# Altium schematic sheet MCU_oscilliation.SchDoc
size A4
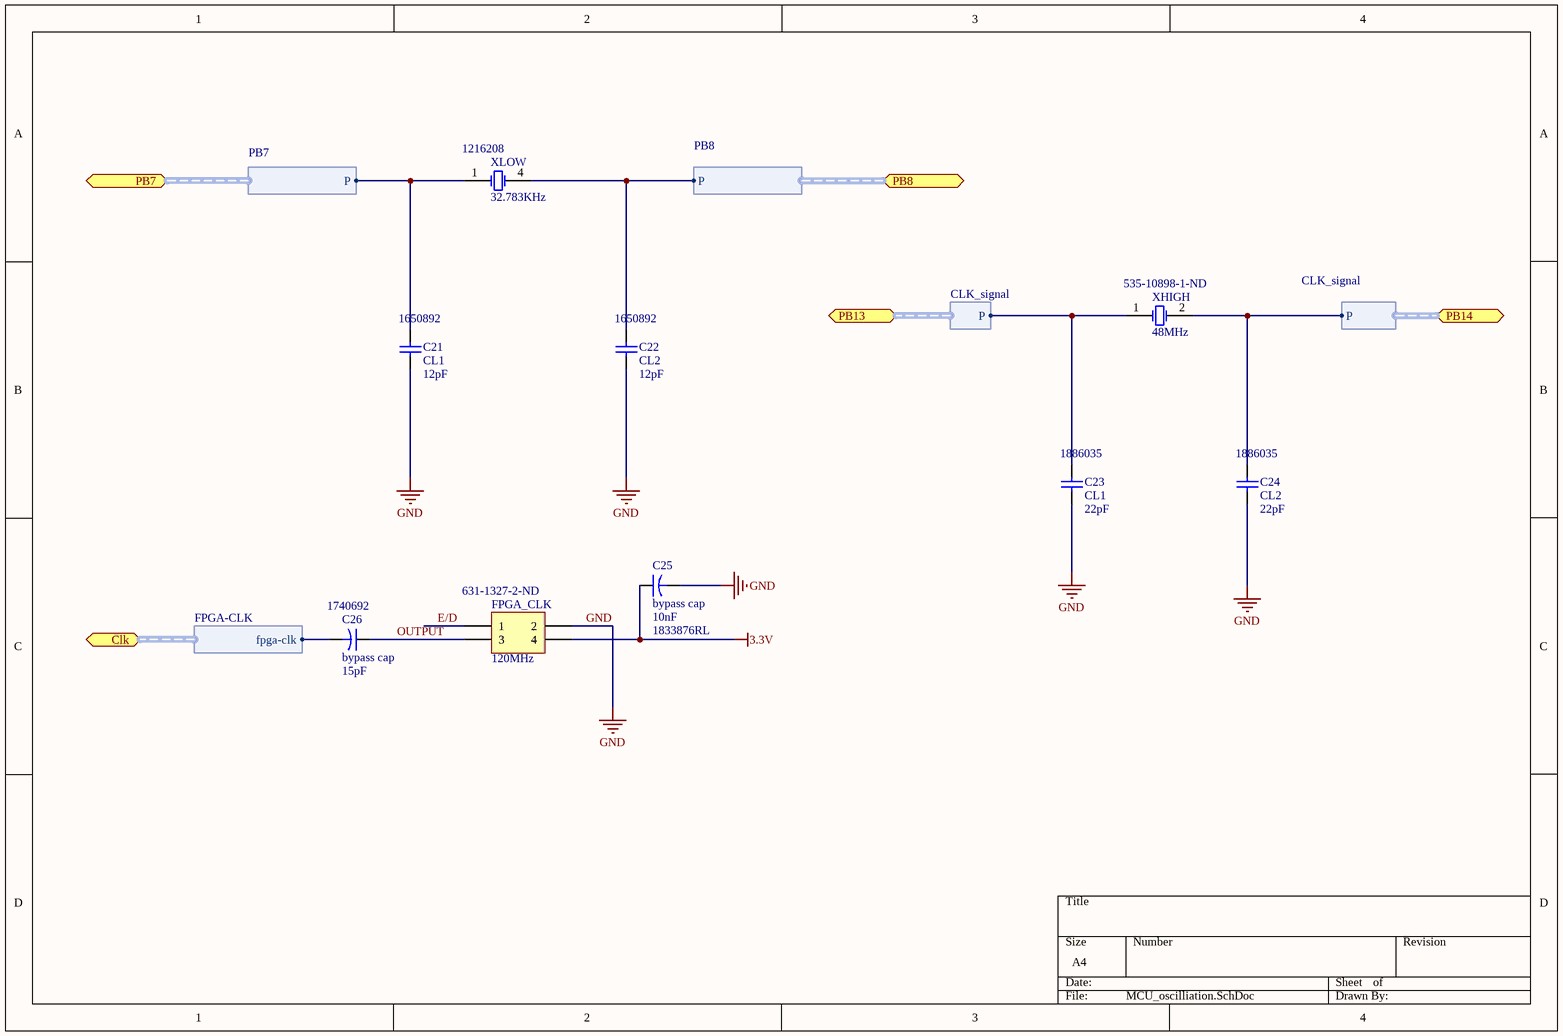
[diagram p0: MCU_oscilliation.SchDoc]

## Parts
C21  CL1  value 12pF  Supplier Part Number 1: 1650892  [C1206]
C22  CL2  value 12pF  Supplier Part Number 1: 1650892  [C1206]
C23  CL1  value 22pF  Supplier Part Number 1: 1886035  [C1206]
C24  CL2  value 22pF  Supplier Part Number 1: 1886035  [C1206]
C25  bypass cap  value 10nF  Supplier Part Number 1: 1833876RL  [C1206]
C26  bypass cap  value 15pF  Supplier Part Number 1: 1740692  [C1206]
FPGA_CLK  120MHz  Supplier Part Number 1: 631-1327-2-ND  [OSCI-4FPGA]
XHIGH  48MHz  Supplier Part Number 1: 535-10898-1-ND  [XTAL-85]
XLOW  32.783KHz  Supplier Part Number 1: 1216208  [MC-306]

## Ports
Clk (harness FPGA-CLK), PB7 (harness PB7), PB8 (harness PB8), PB13 (harness CLK_signal), PB14 (harness CLK_signal)

## Harnesses
PB7: P
PB8: P
CLK_signal: P
FPGA-CLK: fpga-clk

## Nets
3.3V: C25.1 FPGA_CLK.4
GND: C21.1 C22.1 C23.1 C24.1 C25.2 FPGA_CLK.2
E/D: FPGA_CLK.1
OUTPUT: C26.1 FPGA_CLK.3
NetC21_2: C21.2 XLOW.1(OSC1) ; port PB7.P
NetC22_2: C22.2 XLOW.4(OSC2) ; port PB8.P
NetC23_2: C23.2 XHIGH.1(OSC1) ; port PB13.P
NetC24_2: C24.2 XHIGH.2(OSC2) ; port PB14.P
NetC26_2: C26.2 ; port Clk.fpga-clk

## Library data of the parts
C21 C22 = Cap Semi: Capacitor (Semiconductor SIM Model); Manufacturer: KEMET; Manufacturer Part Number: C1206C120J5GACTU; Product Range: KEMET - C Series; Capacitance: 12; Capacitance Tolerance: ± 5%; Dielectric Characteristic: C0G / NP0; Voltage Rating: 50; Ceramic Capacitor Case: 1206 [3216 Metric]; SVHC: No SVHC (16-Dec-2013); Capacitor Terminals: SMD; Temperature Coefficient: 0ppm/°C ± 30; Published: 8-Jun-2000; LatestRevisionDate: 29-May-2009; LatestRevisionNote: IPC-7351 Footprint Added.; PackageReference: C1206; Publisher: Altium Limited; PackageDescription: Chip Capacitor; Supplier 1: Farnell; RoHS: YES; Stock 1: 13114; Pricing 1: 1=1.12, 25=0.95, 50=0.52, 100=0.34, 500=0.29 (EUR); Operating Temperature Min: -55; Operating Temperature Max: 125; Packaging: Cut Tape; MSL: MSL 1 - Unlimited; Capacitance Tolerance ±: ± 5%; Capacitor Case Style: 1206 [3216 Metric]; Operating Temperature Range: -55°C to +125; ComponentLink1URL: http://www.farnell.com/datasheets/1732697.pdf; ComponentLink1Description: http://www.farnell.com/datasheets/1732697.pdf
C23 C24 = Cap Semi: Capacitor (Semiconductor SIM Model); Manufacturer: JOHANSON DIELECTRICS; Manufacturer Part Number: 102R18N220JV4E; Published: 8-Jun-2000; LatestRevisionDate: 29-May-2009; LatestRevisionNote: IPC-7351 Footprint Added.; PackageReference: C1206; Publisher: Altium Limited; PackageDescription: Chip Capacitor; Supplier 1: Farnell; RoHS: YES; Stock 1: 3550; Pricing 1: 50=1.3, 250=0.859, 500=0.626, 1000=0.509, 3000=0.478 (EUR); ComponentLink1URL: http://www.johansondielectrics.com/product-catalog.html; ComponentLink1Description: http://www.johansondielectrics.com/product-catalog.html; ComponentLink2URL: http://www.johansondielectrics.com/images/stories/catalog/JDI_Full-Catalog_2012-01.pdf; ComponentLink2Description: http://www.johansondielectrics.com/images/stories/catalog/JDI_Full-Catalog_2012-01.pdf
C25 C26 = Cap2: Capacitor; Manufacturer: AVX; Manufacturer Part Number: 06031C103JAT2A; Capacitance: 0.01; Capacitance Tolerance: ± 5%; Dielectric Characteristic: X7; Voltage Rating: 100; Ceramic Capacitor Case: 0603 ^1608 Metric]; Published: 23-Sep-2002; PackageReference: CAPR5-4X5; Publisher: Altium Limited; PackageDescription: Capacitor; 2 Leads; RoHS: YES; Product Range: -; Packaging: Cut Tape; ComponentLink1URL: http://www.farnell.com/datasheets/84526.pdf; ComponentLink1Description: http://www.farnell.com/datasheets/84526.pdf; Supplier 1: Farnell
FPGA_CLK = Header 2X2: Header, 2-Pin, Dual row; Manufacturer: Fox Electronics; Manufacturer Part Number: FXO-HC736R-120; Function: Tri-State (Output Enable); Output: HCMOS; Voltage - Supply: 3.3V; Frequency Stability: ±25ppm; Current - Supply (Max): 47mA; LatestRevisionDate: 17-Jul-2002; LatestRevisionNote: Re-released for DXP Platform.; Publisher: Altium Limited; Supplier 1: Digi-Key; RoHS: RoHS Compliant; Category: Crystals and Oscillators; Stock 1: 200; Pricing 1: 1000=1.42097, 3000=1.32297, 5000=1.27398, 10000=1.22498 (EUR); Packaging: Tape & Reel (TR); Type: XO (Standard); Frequency: 120MHz; Operating Temperature: -40°C ~ 85°C; Ratings: -; Mounting Type: Surface Mount; Size / Dimension: 0.295" L x 0.205" W (7.50mm x 5.20mm); Height: 0.055" (1.40mm); Package / Case: 4-SMD, No Lead (DFN, LCC); Current - Supply (Disable) (Max): -; ComponentLink1URL: http://www.foxonline.com/pdfs/FXO_HC73.pdf; ComponentLink1Description: http://www.foxonline.com/pdfs/FXO_HC73.pdf
XHIGH = XTAL: Crystal Oscillator; Manufacturer: Abracon Corporation; Manufacturer Part Number: ABM2-48.000MHZ-D4YF-T; Frequency Stability: ±30ppm; Load Capacitance: 18pF; ESR (Equivalent Series Resistance): 70 Ohm; Operating Mode: 3rd Overtone; Published: 8-Jun-2000; LatestRevisionDate: 17-Jul-2002; LatestRevisionNote: Re-released for DXP Platform.; PackageReference: R38; Publisher: Altium Limited; PackageDescription: Crystal, Thru-Hole; 2 Leads; Body 3.1 x 8.2 mm (Dia.xH); Supplier 1: Digi-Key; RoHS: RoHS Compliant; Category: Crystals and Oscillators; Stock 1: 1458; Pricing 1: 1=0.62, 10=0.525, 50=0.4708, 100=0.4189, 500=0.39894 (EUR); Packaging: Cut Tape (CT); Type: MHz Crystal; Frequency: 48MHz; Frequency Tolerance: ±30ppm; Operating Temperature: -40°C ~ 85°C; Ratings: -; Mounting Type: Surface Mount; Package / Case: 2-SMD; Size / Dimension: 0.315" L x 0.177" W (8.00mm x 4.50mm); Height: 0.063" (1.60mm); ComponentLink1URL: http://www.abracon.com/Resonators/abm2.pdf; ComponentLink1Description: http://www.abracon.com/Resonators/abm2.pdf
XLOW = XTAL: Crystal Oscillator; Manufacturer: EPSON; Manufacturer Part Number: Q13MC30610003; Frequency: 32.768; Frequency Tolerance: ± 20; Load Capacitance: 12.5; Crystal Mounting Type: SMD; Crystal Case Type: 8mm x 3.8; No. of Pins: 4; SVHC: No SVHC (16-Jun-2014); Published: 8-Jun-2000; LatestRevisionDate: 17-Jul-2002; LatestRevisionNote: Re-released for DXP Platform.; PackageReference: R38; Publisher: Altium Limited; PackageDescription: Crystal, Thru-Hole; 2 Leads; Body 3.1 x 8.2 mm (Dia.xH); Supplier 1: Farnell; RoHS: YES; Stock 1: 7540; Pricing 1: 1=9.75, 10=7.95, 100=4.85, 250=4.1, 900=3.65, 3000=3.3, 3000=3, 20000=2.8 (EUR); Frequency Stability: -; Operating Temperature Min: -40; Operating Temperature Max: 85; Packaging: Cut Tape<!--FANDB--><div class="features-and-benefits-container"></div>; ComponentLink1URL: http://www.epsondevice.com/docs/qd/en/DownloadServlet?id=ID000663; ComponentLink1Description: http://www.epsondevice.com/docs/qd/en/DownloadServlet?id=ID000663